# Altium project VirtualWire.PrjPcb
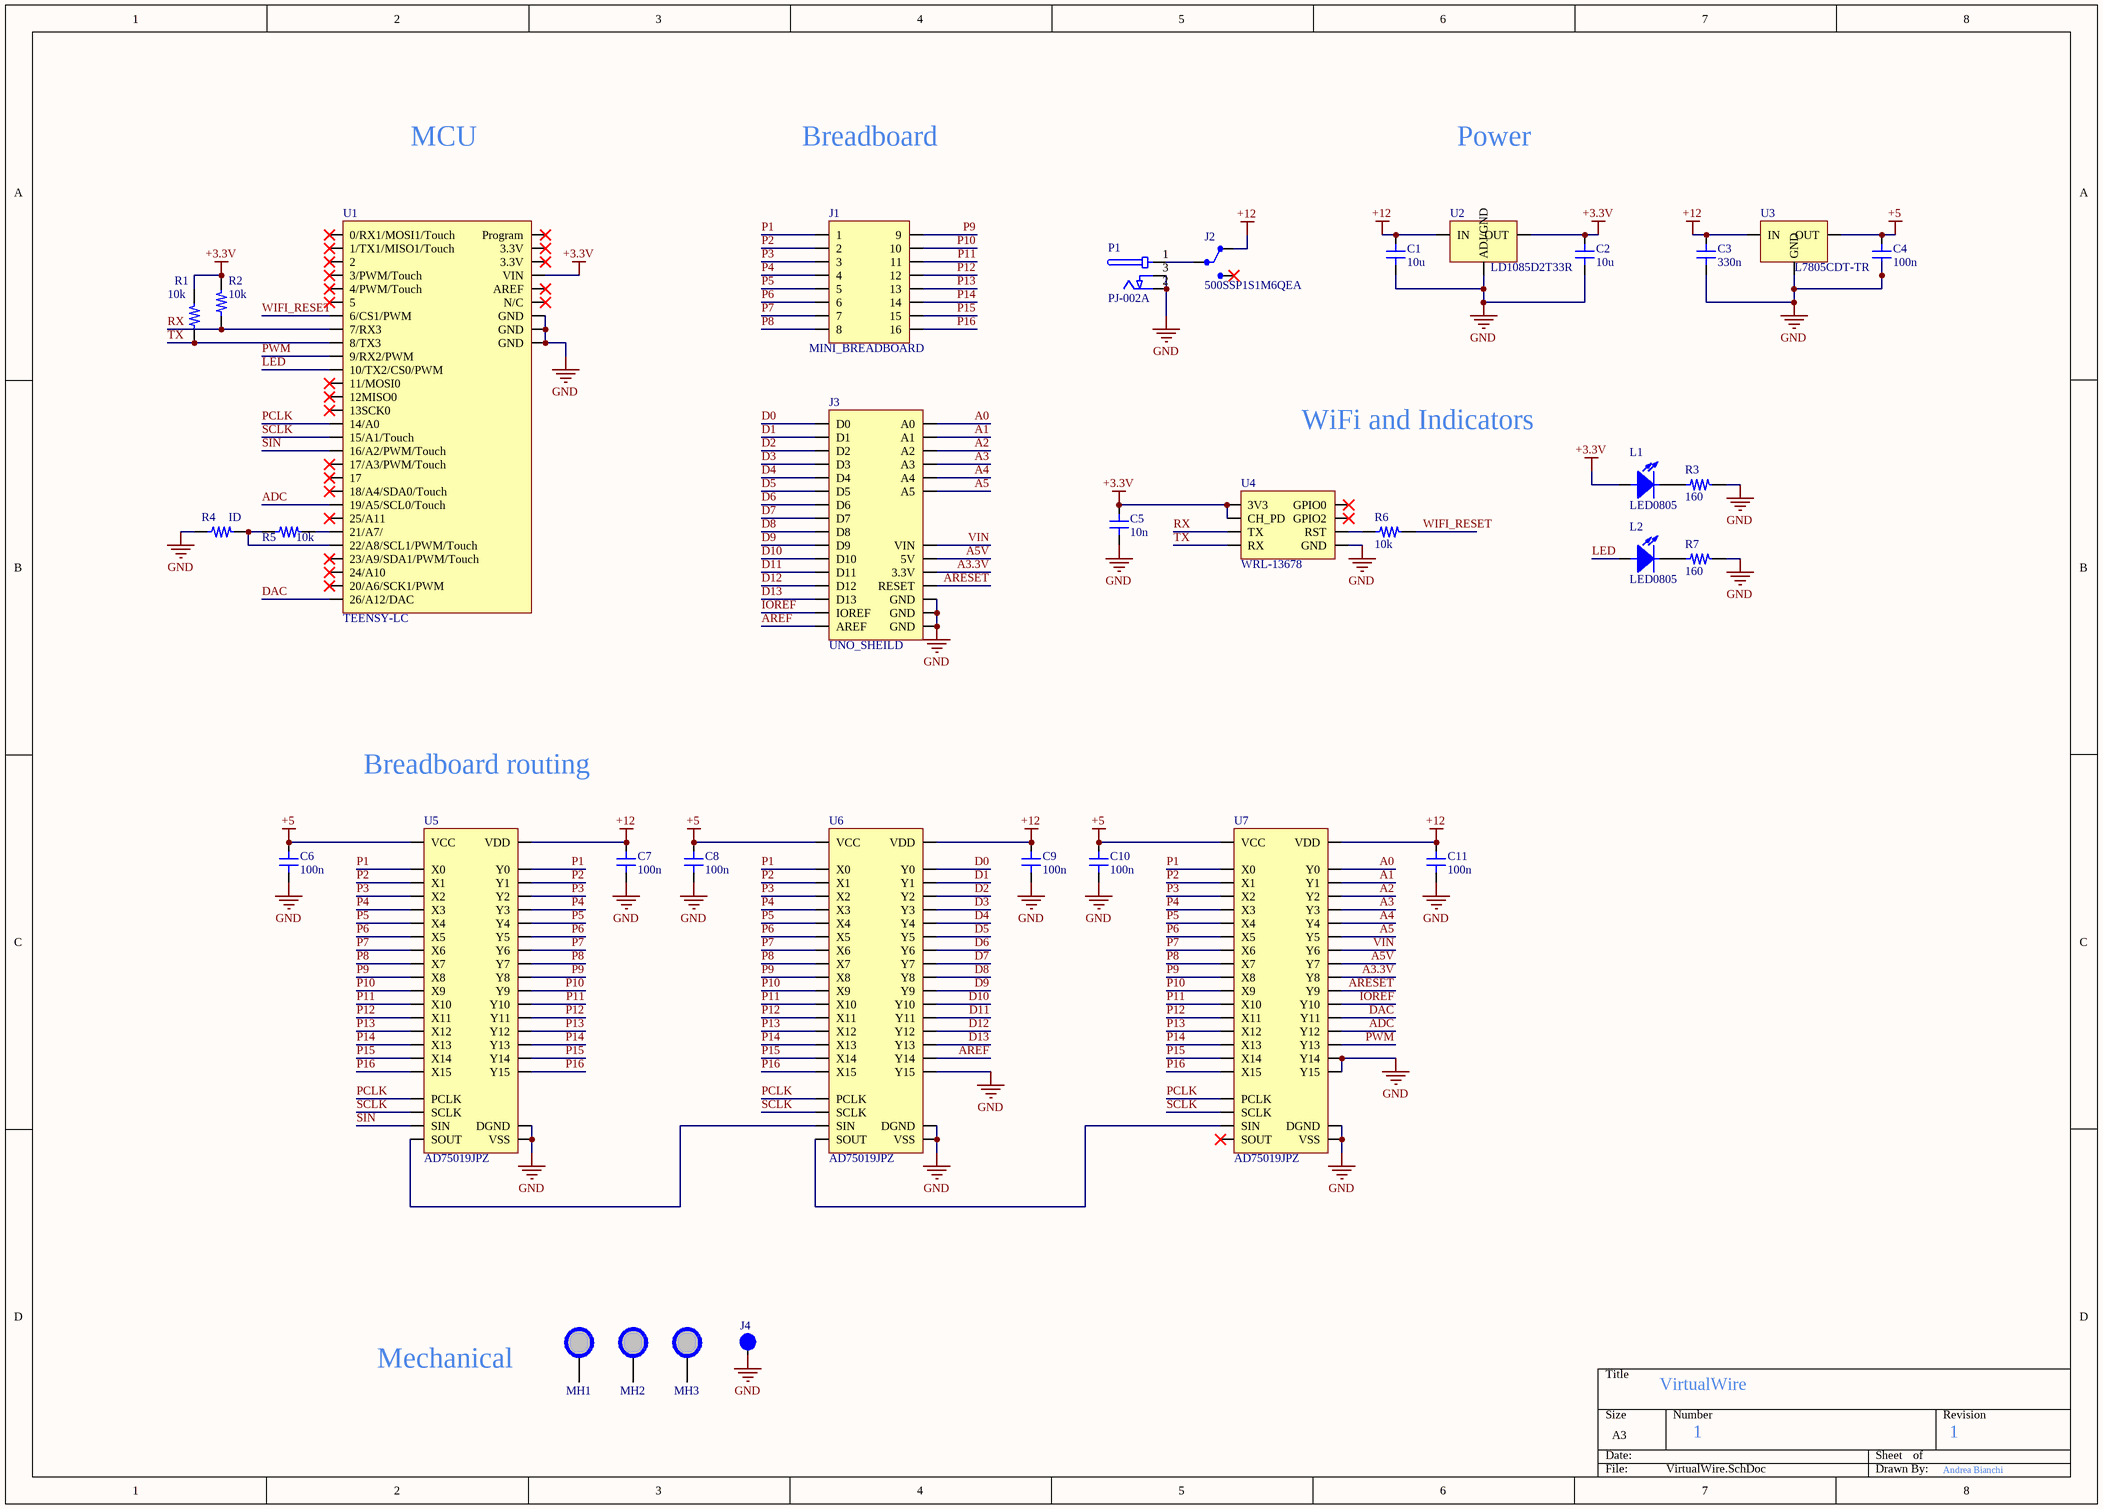
[diagram p0: VirtualWire.SchDoc]
1 sheet, 35 parts. Net scope: global (net labels, ports and power ports of the same name join across sheets).
Board file: VirtualWire.PcbDoc

## Sheet VirtualWire.SchDoc
size A3

### Parts
C1  10u  [C0805]
C2  10u  [C0805]
C3  330n  [C0805]
C4  100n  [C0805]
C5  10n  [C0805]
C6  100n  [C0805]
C7  100n  [C0805]
C8  100n  [C0805]
C9  100n  [C0805]
C10  100n  [C0805]
C11  100n  [C0805]
J1  MINI_BREADBOARD  [MINI_BREADBOARD HOLE]
J2  500SSP1S1M6QEA  [SLIDE SPDT]
J3  UNO_SHEILD  [ARDUINO_UNO_SHIELD]
J4  EPAD  [EPAD]  (value not drawn)
L1  LED0805  [LED0805]  (no BOM)
L2  LED0805  [LED0805]  (no BOM)
MH1  MH 3.2mm NP  [MH3.2mm]  (value not drawn)  (no BOM)
MH2  MH 3.2mm NP  [MH3.2mm]  (value not drawn)  (no BOM)
MH3  MH 3.2mm NP  [MH3.2mm]  (value not drawn)  (no BOM)
P1  PJ-002A  [PJ-002A]
R1  10k  [R0805]
R2  10k  [R0805]
R3  160  [R0805]
R4  ID  [R0805]
R5  10k  [R0805]
R6  10k  [R0805]
R7  160  [R0805]
U1  TEENSY-LC  [TEENSY-LC]
U2  LD1085D2T33R  [D2PAK]
U3  L7805CDT-TR  [DPAK]
U4  WRL-13678  [ESP8266]
U5  AD75019JPZ  [PLCC44_DIP]
U6  AD75019JPZ  [PLCC44_DIP]
U7  AD75019JPZ  [PLCC44_DIP]

### Nets
+3.3V: C2.2 C5.2 L1.2(A) R1.2 R2.2 U1.33(VIN) U2.4(OUT) U4.2(CH_PD) U4.4(3V3)
+5: C4.2 C6.2 C8.2 C10.2 U3.3(OUT) U5.42(VCC) U6.42(VCC) U7.42(VCC)
+12: C1.2 C3.2 C7.2 C9.2 C11.2 J2.1 U2.3(IN) U3.1(IN) U5.41(VDD) U6.41(VDD) U7.41(VDD)
GND: C1.1 C2.1 C3.1 C4.1 C5.1 C6.1 C7.1 C8.1 C9.1 C10.1 C11.1 J3.15(GND) J3.24(GND) J3.25(GND) J4.1 P1.2 P1.3 R3.2 R4.1 R7.2 U1.1(GND) U1.17(GND) U1.32(GND) U2.1(ADJ/GND) U3.4(GND) U4.8(GND) U5.4(VSS) U5.43(DGND) U6.4(VSS) U6.7(Y15) U6.43(DGND) U7.4(VSS) U7.7(Y15) U7.8(Y14) U7.43(DGND)
A0: J3.22(A0) U7.31(Y0)
A1: J3.21(A1) U7.32(Y1)
A2: J3.20(A2) U7.33(Y2)
A3: J3.19(A3) U7.34(Y3)
A3.3V: J3.27(3.3V) U7.14(Y8)
A4: J3.18(A4) U7.35(Y4)
A5: J3.17(A5) U7.36(Y5)
A5V: J3.26(5V) U7.38(Y7)
ADC: U1.26(19/A5/SCL0/Touch) U7.10(Y12)
AREF: J3.16(AREF) U6.8(Y14)
ARESET: J3.28(RESET) U7.13(Y9)
D0: J3.1(D0) U6.31(Y0)
D1: J3.2(D1) U6.32(Y1)
D2: J3.3(D2) U6.33(Y2)
D3: J3.4(D3) U6.34(Y3)
D4: J3.5(D4) U6.35(Y4)
D5: J3.6(D5) U6.36(Y5)
D6: J3.7(D6) U6.37(Y6)
D7: J3.8(D7) U6.38(Y7)
D8: J3.9(D8) U6.14(Y8)
D9: J3.10(D9) U6.13(Y9)
D10: J3.11(D10) U6.12(Y10)
D11: J3.12(D11) U6.11(Y11)
D12: J3.13(D12) U6.10(Y12)
D13: J3.14(D13) U6.9(Y13)
DAC: U1.19(26/A12/DAC) U7.11(Y11)
IOREF: J3.29(IOREF) U7.12(Y10)
LED: L2.2(A) U1.12(10/TX2/CS0/PWM)
P1: J1.1 U5.15(X0) U5.31(Y0) U6.15(X0) U7.15(X0)
P2: J1.2 U5.16(X1) U5.32(Y1) U6.16(X1) U7.16(X1)
P3: J1.3 U5.17(X2) U5.33(Y2) U6.17(X2) U7.17(X2)
P4: J1.4 U5.18(X3) U5.34(Y3) U6.18(X3) U7.18(X3)
P5: J1.5 U5.19(X4) U5.35(Y4) U6.19(X4) U7.19(X4)
P6: J1.6 U5.20(X5) U5.36(Y5) U6.20(X5) U7.20(X5)
P7: J1.7 U5.21(X6) U5.37(Y6) U6.21(X6) U7.21(X6)
P8: J1.8 U5.22(X7) U5.38(Y7) U6.22(X7) U7.22(X7)
P9: J1.9 U5.14(Y8) U5.23(X8) U6.23(X8) U7.23(X8)
P10: J1.10 U5.13(Y9) U5.24(X9) U6.24(X9) U7.24(X9)
P11: J1.11 U5.12(Y10) U5.25(X10) U6.25(X10) U7.25(X10)
P12: J1.12 U5.11(Y11) U5.26(X11) U6.26(X11) U7.26(X11)
P13: J1.13 U5.10(Y12) U5.27(X12) U6.27(X12) U7.27(X12)
P14: J1.14 U5.9(Y13) U5.28(X13) U6.28(X13) U7.28(X13)
P15: J1.15 U5.8(Y14) U5.29(X14) U6.29(X14) U7.29(X14)
P16: J1.16 U5.7(Y15) U5.30(X15) U6.30(X15) U7.30(X15)
PCLK: U1.21(14/A0) U5.1(PCLK) U6.1(PCLK) U7.1(PCLK)
PWM: U1.11(9/RX2/PWM) U7.9(Y13)
RX: R2.1 U1.9(7/RX3) U4.1(TX)
SCLK: U1.22(15/A1/Touch) U5.2(SCLK) U6.2(SCLK) U7.2(SCLK)
SIN: U1.23(16/A2/PWM/Touch) U5.3(SIN)
TX: R1.1 U1.10(8/TX3) U4.5(RX)
VIN: J3.23(VIN) U7.37(Y6)
WIFI_RESET: R6.2 U1.8(6/CS1/PWM)
NetJ2_2: J2.2 P1.1
NetL1_1: L1.1(C) R3.1
NetL2_1: L2.1(C) R7.1
NetR4_2: R4.2 R5.1 U1.29(22/A8/SCL1/PWM/Touch)
NetR5_2: R5.2 U1.28(21/A7/)
NetR6_1: R6.1 U4.3(RST)
NetU5_44: U5.44(SOUT) U6.3(SIN)
NetU6_44: U6.44(SOUT) U7.3(SIN)

Not connected (* = marked no-connect by the designer): J2 3*; MH1 1; MH2 1; MH3 1; U1 2(0/RX1/MOSI1/Touch)* 3(1/TX1/MISO1/Touch)* 4(2)* 5(3/PWM/Touch)* 6(4/PWM/Touch)* 7(5)* 13(11/MOSI0)* 14(12MISO0)* 15(17)* 16(3.3V)* 18(Program)* 20(13SCK0)* 24(17/A3/PWM/Touch)* 25(18/A4/SDA0/Touch)* 27(20/A6/SCK1/PWM)* 30(23/A9/SDA1/PWM/Touch)* 31(3.3V)* 34(N/C)* 35(AREF)* 36(24/A10)* 37(25/A11)*; U4 6(GPIO0)* 7(GPIO2)*; U5 5(NC) 6(NC) 39(NC) 40(NC); U6 5(NC) 6(NC) 39(NC) 40(NC); U7 5(NC) 6(NC) 39(NC) 40(NC) 44(SOUT)*

### Notes on the sheet
- MCU
- Breadboard
- Power
- WiFi and Indicators
- Breadboard routing
- Mechanical
- VirtualWire
- 1
- Andrea Bianchi

### Library data of the parts
C1 C2 = C805_10u: 10uF
C3 = C805_330n: 330nF
C4 C6-C11 = C805_100n: 100nF
C5 = C805_10n: 10nF
J1 = MINI_BREADBOARD: Mini Breadboard 16x2
J2 = SLIDE SPDT: SWITCH SLIDE SPDT 5A 120V; Manufacturer: E-Switch; Mechanical Life: 30000Cycles; Actuator Material: Nylon,Polyamide; Max Voltage Rating (AC): 250V; Voltage Rating (DC): 28V; Contact Resistance: 10mR; Switch Travel: 2.16mm; Switch Function: On-On; Actuator Length: 4.72mm; Supplier 1: Digi-Key; Manufacturer Part Number: 500SSP1S1M6QEA; Stock 1: 6111; Mount: Through Hole,Brackets; Contact Plating: Silver; Contact Material: Copper,Silver,Copper Alloy; Housing Material: Stainless Steel; Min Operating Temperature: -30°C; Max Operating Temperature: 85°C; Contact Current Rating: 5A; Voltage Rating (AC): 120V; Throw Configuration: SPDT; Package Quantity: 1; Packaging: Bulk; Current Rating: 5A; Max Voltage Rating (DC): 28V; Termination: PC Pin; Electrical Life: 30000Cycles; Orientation: Right Angle; REACH SVHC: Unknown; Lead Free: Lead Free; Flammability Rating: UL94 V-0; ComponentLink1URL: https://datasheet.ciiva.com/16337/500-16337624.pdf; ComponentLink1Description: https://datasheet.ciiva.com/16337/500-16337624.pdf; ComponentLink2URL: https://datasheet.ciiva.com/16174/35500-16174234.pdf; ComponentLink2Description: https://datasheet.ciiva.com/16174/35500-16174234.pdf; ComponentLink3URL: https://datasheet.ciiva.com/2889/t511006d-2889419.pdf; ComponentLink3Description: https://datasheet.ciiva.com/2889/t511006d-2889419.pdf; Supplier Part Number 1: EG2478-ND; Pricing 1: 1=2.93, 10=2.808, 25=2.7484, 50=2.39, 100=2.3303, 250=2.27052, 500=1.912, 1000=1.7925, 5000=1.64313 (USD)
J3 = ARDUINO_UNO_SHIELD
J4 = EPAD: Exposed PAD
L1 L2 = LED0805: LED0805 any color
MH1-MH3 = MHNP: Mounting hole 3.2mm non plated
P1 = PJ-002A: PJ-002 Series 2 x 6.5 mm 16 V Right Angle Through Hole Power Jack; Manufacturer: CUI; Gender: Male; Shielding: Unshielded; Current Rating: 2.5A; Voltage Rating: 24V; Insulation Resistance: 50MR; Number of Conductors: 2; Supplier 1: Digi-Key; Manufacturer Part Number: PJ-002A; Stock 1: 133077; Mount: Through Hole; Contact Material: Copper,Copper Alloy; Contact Plating: Nickel,Tin; Housing Colour: Black; Housing Material: Thermoplastic; Colour: Black; Min Operating Temperature: -25°C; Max Operating Temperature: 85°C; Termination: Through Hole; Connector Type: Jack; Packaging: Bulk; Package Quantity: 500; Contact Gender: Male; Orientation: Horizontal; Diameter: 2.1mm; Lead Free: Lead Free; Flammability Rating: UL94 V-0; ComponentLink1URL: http://www.cui.com/product/resource/digikeypdf/pj-002a.pdf; ComponentLink1Description: http://www.cui.com/product/resource/digikeypdf/pj-002a.pdf; ComponentLink2URL: http://www.cui.com/Product/Resource/FuturePDF/PJ-002A.pdf; ComponentLink2Description: http://www.cui.com/Product/Resource/FuturePDF/PJ-002A.pdf; ComponentLink3URL: http://www.mouser.com/ds/2/670/pj-002a-515880.pdf; ComponentLink3Description: http://www.mouser.com/ds/2/670/pj-002a-515880.pdf; Supplier Part Number 1: CP-002A-ND
R1 R2 R4-R6 = R0805_10k
R3 R7 = R0805_160: 160 Ohm
U1 = TEENSY-LC: DEV TEENSY LC 13305; Manufacturer: SparkFun; Manufacturer Part Number: DEV-13305; Supplier 1: Digi-Key; Stock 1: 1201; Supplier Part Number 1: 1568-1233-ND; Pricing 1: 1 = 14.38000 (USD)
U2 = LD1085D2T33R: Fixed LDO Voltage Regulator, 6.3V to 30V, 1.3V Dropout, 3.3Vout, 3Aout, TO-263-3; Manufacturer: STMicroelectronics; Number of Outputs: 1; Max Output Current: 3A; Output Voltage: 3.3V; Min Supply Voltage: 4.9V; Input Bias Current: 5mA; Polarity: Positive; Quiescent Current: 10mA; Max Output Voltage: 3.333V; Accuracy: 1%; Supplier 1: Digi-Key; Manufacturer Part Number: LD1085D2T33R; Stock 1: 5416; Mount: Surface Mount; Case/Package: TO-263; Number of Pins: 3; Weight: 0.01lb; Contact Plating: Tin,Matte; Min Operating Temperature: -40°C; Max Operating Temperature: 125°C; Packaging: Tape and Reel; Max Input Voltage: 30V; Dropout Voltage: 1.3V; Output Current: 3A; Max Supply Voltage: 30V; Package Quantity: 1; Min Input Voltage: 6.3V; Nominal Output Voltage: 3.3V; Number of Regulators: 1; Min Output Voltage: 3.3V; Termination: SMD/SMT; Output Voltage Accuracy: 1%; Length: 10.4mm; Height: 4.6mm; Width: 9.35mm; Radiation Hardening: No; REACH SVHC: No SVHC; Lead Free: Lead Free; ComponentLink1URL: https://datasheet.ciiva.com/16375/cd00001883-16375381.pdf; ComponentLink1Description: https://datasheet.ciiva.com/16375/cd00001883-16375381.pdf; ComponentLink2URL: https://datasheet.ciiva.com/1511/1761309-1511542.pdf; ComponentLink2Description: https://datasheet.ciiva.com/1511/1761309-1511542.pdf; ComponentLink3URL: https://datasheet.ciiva.com/22694/1761309-22694841.pdf; ComponentLink3Description: https://datasheet.ciiva.com/22694/1761309-22694841.pdf; ComponentLink4URL: https://datasheet.ciiva.com/2044/cd00001883-2044187.pdf; ComponentLink4Description: https://datasheet.ciiva.com/2044/cd00001883-2044187.pdf; ComponentLink5URL: https://datasheet.ciiva.com/15111/getdatasheetpartid-65476-15111291.pdf; ComponentLink5Description: https://datasheet.ciiva.com/15111/getdatasheetpartid-65476-15111291.pdf; ComponentLink6URL: https://datasheet.ciiva.com/2044/cd00001883-2044188.pdf; ComponentLink6Description: https://datasheet.ciiva.com/2044/cd00001883-2044188.pdf; ComponentLink7URL: https://datasheet.ciiva.com/2044/cd00001883-2044189.pdf; ComponentLink7Description: https://datasheet.ciiva.com/2044/cd00001883-2044189.pdf; ComponentLink8URL: https://datasheet.ciiva.com/41439/001184676-da-01-en-ic-reg-ldo-3-3-ld1085d2t33r-to-263-3-stm-41439834.pdf; ComponentLink8Description: https://datasheet.ciiva.com/41439/001184676-da-01-en-ic-reg-ldo-3-3-ld1085d2t33r-to-263-3-stm-41439834.pdf; Supplier Part Number 1: 497-1222-6-ND; Pricing 1: 1=1.46, 10=1.305, 100=1.0176, 500=0.84066 (USD)
U3 = L7805CDT-TR: IC REG LDO 5V 1.5A DPAK; Manufacturer: STMicroelectronics; Dropout Voltage: 2V; Number of Outputs: 1; Max Input Voltage: 35V; Min Input Voltage: 7V; Polarity: Positive; Quiescent Current: 8mA; Power Supply Rejection Ratio (PSRR): 62dB; Supplier 1: Digi-Key; Manufacturer Part Number: L7805CDT-TR; Stock 1: 7500; Mount: Surface Mount; Case/Package: TO-252; Number of Pins: 3; Contact Plating: Tin,Matte; Min Operating Temperature: 0°C; Max Operating Temperature: 125°C; Package Quantity: 1; Packaging: Tape and Reel; Max Output Current: 1.5A; Output Voltage: 5V; Output Current: 1.5A; Number of Regulators: 1; Min Output Voltage: 5V; Length: 6.6mm; Height: 2.4mm; Width: 6.2mm; Radiation Hardening: No; Lead Free: Lead Free; ComponentLink1URL: https://datasheet.ciiva.com/2042/cd00000444-2042784.pdf; ComponentLink1Description: https://datasheet.ciiva.com/2042/cd00000444-2042784.pdf; ComponentLink2URL: https://datasheet.ciiva.com/2042/cd00000444-2042785.pdf; ComponentLink2Description: https://datasheet.ciiva.com/2042/cd00000444-2042785.pdf; ComponentLink3URL: https://datasheet.ciiva.com/16357/cd00000444-16357893.pdf; ComponentLink3Description: https://datasheet.ciiva.com/16357/cd00000444-16357893.pdf; ComponentLink4URL: https://datasheet.ciiva.com/4882/cd00000444-4882231.pdf; ComponentLink4Description: https://datasheet.ciiva.com/4882/cd00000444-4882231.pdf; ComponentLink5URL: https://datasheet.ciiva.com/17360/cd00000444-17360220.pdf; ComponentLink5Description: https://datasheet.ciiva.com/17360/cd00000444-17360220.pdf; ComponentLink6URL: https://datasheet.ciiva.com/2042/cd00000444-2042783.pdf; ComponentLink6Description: https://datasheet.ciiva.com/2042/cd00000444-2042783.pdf; ComponentLink7URL: https://datasheet.ciiva.com/26904/l7805cdt-tr-26904768.pdf; ComponentLink7Description: https://datasheet.ciiva.com/26904/l7805cdt-tr-26904768.pdf; Supplier Part Number 1: 497-7255-2-ND
U4 = ESP8266: WIFI ESP8266 MOD WIFI TRACE ANT; Manufacturer: SparkFun; Supplier 1: Digi-Key; Manufacturer Part Number: WRL-13678; Stock 1: 1618; ComponentLink1URL: https://nurdspace.nl/images/e/e0/ESP8266_Specifications_English.pdf; ComponentLink1Description: https://nurdspace.nl/images/e/e0/ESP8266_Specifications_English.pdf; Supplier Part Number 1: 1568-1235-ND; Pricing 1: 1=6.95 (USD)
U5-U7 = AD75019JPZ: SWITCH CROSSPOINT 16X16, SMD, 75019; Manufacturer: Analog Devices; Crosspoint Switch Type: Analogue; Control Interface: Serial; Supply Voltage Min: 4.5V; Supply Voltage Max: 5.5V; Digital IC Case: LCC; No. of Pins: 44Pins; SVHC: No SVHC (17-Dec-2015); Supplier 1: Digi-Key; Manufacturer Part Number: AD75019JPZ; Stock 1: 792; Input / Output Configuration: -; Operating Temperature Min: -25°C; Operating Temperature Max: 85°C; Packaging: Each; Product Range: -; MSL: MSL 3 - 168 hours; ComponentLink1URL: https://datasheet.ciiva.com/3036/ad75019-3036466.pdf; ComponentLink1Description: https://datasheet.ciiva.com/3036/ad75019-3036466.pdf; ComponentLink2URL: https://datasheet.ciiva.com/1170/66420-1170438.pdf; ComponentLink2Description: https://datasheet.ciiva.com/1170/66420-1170438.pdf; ComponentLink3URL: https://datasheet.ciiva.com/26824/ad75019jpz-26824058.pdf; ComponentLink3Description: https://datasheet.ciiva.com/26824/ad75019jpz-26824058.pdf; Supplier Part Number 1: AD75019JPZ-ND